# EAGLE design amplifier (EAGLE 9.3.0)
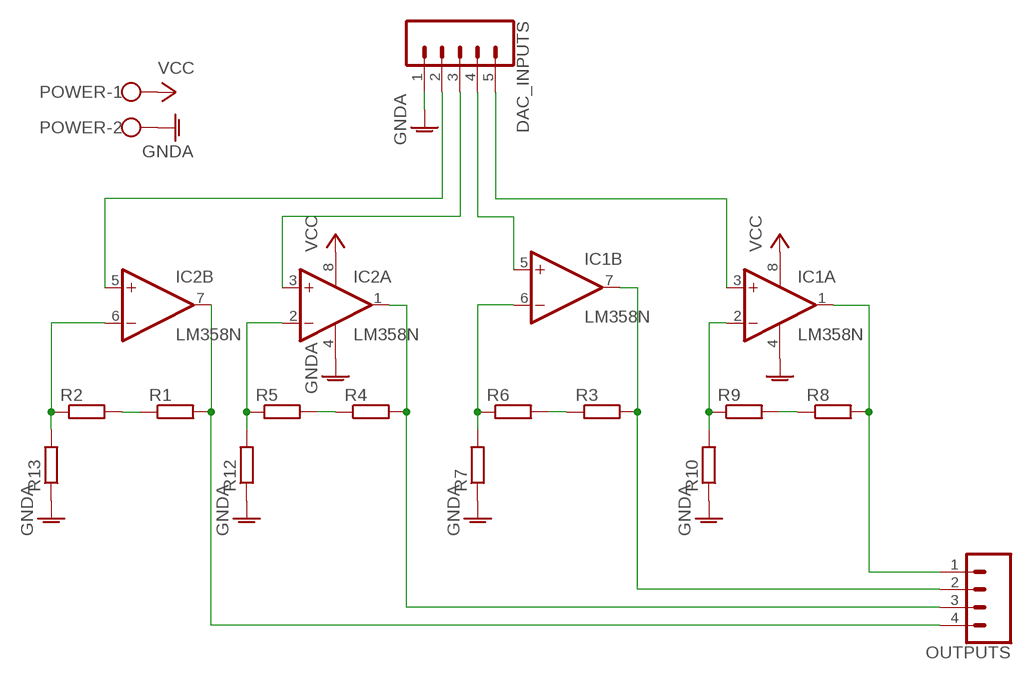
[diagram p0: schematic, sheet 1]

## Parts
DAC_INPUTS  CONN_05  [1X05]
IC1  LM358N  [DIL08]
IC2  LM358N  [DIL08]
OUTPUTS  CONN_04  [1X04]
POWER  W237-102  [W237-102]
R1  R-EU_0204/7  [0204/7]
R2  R-EU_0204/7  [0204/7]
R3  R-EU_0204/7  [0204/7]
R4  R-EU_0204/7  [0204/7]
R5  R-EU_0204/7  [0204/7]
R6  R-EU_0204/7  [0204/7]
R7  R-EU_0204/7  [0204/7]
R8  R-EU_0204/7  [0204/7]
R9  R-EU_0204/7  [0204/7]
R10  R-EU_0204/7  [0204/7]
R12  R-EU_0204/7  [0204/7]
R13  R-EU_0204/7  [0204/7]

## Nets
GNDA: DAC_INPUTS.1 IC1.4(P:V-) IC2.4(P:V-) POWER.2 R7.1 R10.1 R12.1 R13.1
N$1: DAC_INPUTS.5 IC1.3(A:+IN)
N$2: DAC_INPUTS.3 IC2.3(A:+IN)
N$3: DAC_INPUTS.4 IC1.5(B:+IN)
N$4: DAC_INPUTS.2 IC2.5(B:+IN)
N$5: IC2.1(A:OUT) OUTPUTS.3 R4.2
N$6: IC2.2(A:-IN) R5.1 R12.2
N$7: R4.1 R5.2
N$8: IC2.7(B:OUT) OUTPUTS.4 R1.2
N$9: R1.1 R2.2
N$10: IC2.6(B:-IN) R2.1 R13.2
N$11: R3.1 R6.2
N$12: IC1.6(B:-IN) R6.1 R7.2
N$13: IC1.7(B:OUT) OUTPUTS.2 R3.2
N$14: R8.1 R9.2
N$15: IC1.2(A:-IN) R9.1 R10.2
N$16: IC1.1(A:OUT) OUTPUTS.1 R8.2
VCC: IC1.8(P:V+) IC2.8(P:V+) POWER.1

## Library data of the parts
DAC_INPUTS = SparkFun-Connectors:CONN_05: Multi connection point. Often used as Generic Header-pin footprint for 0.1 inch spaced/style header connections On any of the 0.1 inch spaced packages, you can populate with these: Break Away Headers - Straight <https://www.sparkfun.com/products/116> (PRT-00116) Break Away Male Headers - Right Angle <https://www.sparkfun.com/products/553> (PRT-00553) Female Headers <https://www.sparkfun.com/products/115> (PRT-00115) Break Away Headers - Machine Pin <https://www.sparkfun.com/products/117> (PRT-00117) Break Away Female Headers - Swiss Machine Pin <https://www.sparkfun.com/products/743> (PRT-00743) For SCREWTERMINALS and SPRING TERMINALS visit here: Screw Terimnals on SparkFun.com <https://www.sparkfun.com/search/results?term=Screw+Terminals> (5mm/3.5mm/2.54mm spacing) This device is also useful as a general connection point to wire up your design to another part of your project. Our various solder wires solder well into these plated through hole pads. Hook-Up Wire - Assortment (Stranded, 22 AWG) <https://www.sparkfun.com/products/11375> (PRT-11375) Hook-Up Wire - Assortment (Solid Core, 22 AWG) <https://www.sparkfun.com/products/11367> (PRT-11367) View the entire wire category on our website here <https://www.sparkfun.com/categories/141> Special notes: Molex polarized connector foot print use with SKU : PRT-08231 with associated crimp pins and housings. 1MM SMD Version SKU: PRT-10208
IC1 IC2 = linear:LM358: OP AMP also LM158; LM258; LM2904 Source: http://cache.national.com/ds/LM/LM158.pdf
OUTPUTS = SparkFun-Connectors:CONN_04: Multi connection point. Often used as Generic Header-pin footprint for 0.1 inch spaced/style header connections On any of the 0.1 inch spaced packages, you can populate with these: Break Away Headers - Straight <https://www.sparkfun.com/products/116> (PRT-00116) Break Away Male Headers - Right Angle <https://www.sparkfun.com/products/553> (PRT-00553) Female Headers <https://www.sparkfun.com/products/115> (PRT-00115) Break Away Headers - Machine Pin <https://www.sparkfun.com/products/117> (PRT-00117) Break Away Female Headers - Swiss Machine Pin <https://www.sparkfun.com/products/743> (PRT-00743) For SCREWTERMINALS and SPRING TERMINALS visit here: Screw Terimnals on SparkFun.com <https://www.sparkfun.com/search/results?term=Screw+Terminals> (5mm/3.5mm/2.54mm spacing) This device is also useful as a general connection point to wire up your design to another part of your project. Our various solder wires solder well into these plated through hole pads. Hook-Up Wire - Assortment (Stranded, 22 AWG) <https://www.sparkfun.com/products/11375> (PRT-11375) Hook-Up Wire - Assortment (Solid Core, 22 AWG) <https://www.sparkfun.com/products/11367> (PRT-11367) View the entire wire category on our website here <https://www.sparkfun.com/categories/141> Special notes: Molex polarized connector foot print use with SKU : PRT-08231 with associated crimp pins and housings. 1MM SMD Version SKU: PRT-10208; PROD_ID: CONN-09696
POWER = con-wago-500:W237-102: WAGO SCREW CLAMP; MPN: 237-102; OC_FARNELL: unknown; OC_NEWARK: 70K9898
R1-R10 R12 R13 = rcl:R-EU_: RESISTOR, European symbol; SPICEPREFIX: R

## Board
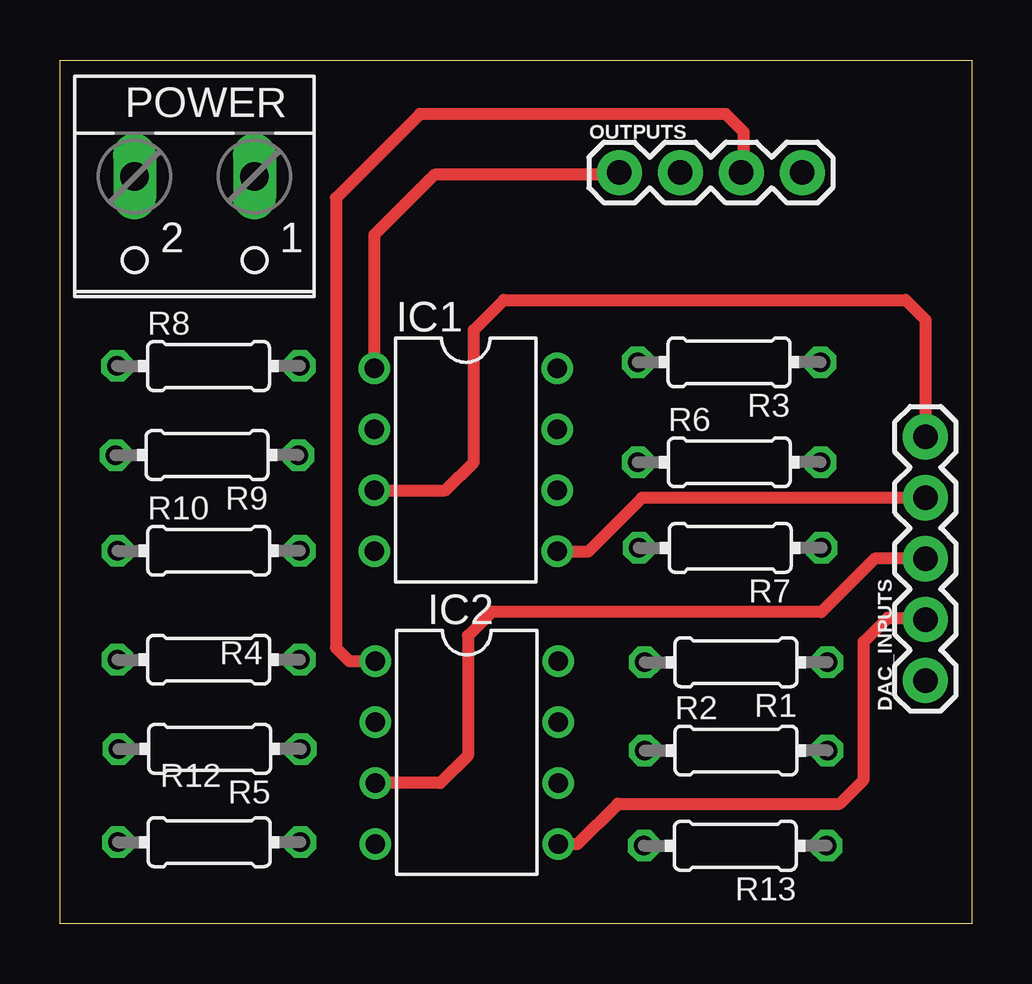
[diagram p1: board, top side]
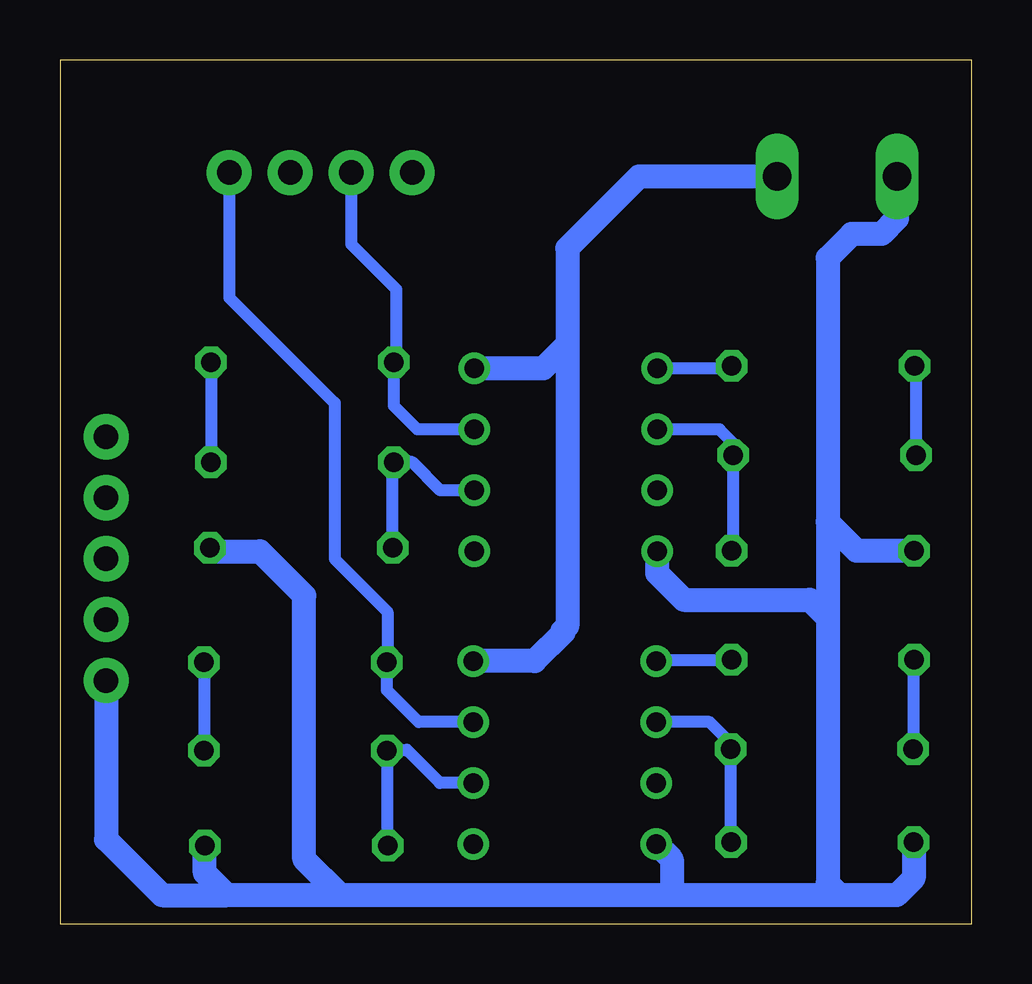
[diagram p2: board, bottom side, seen from below]

Size 38 x 36 mm. Coordinates in mm from the lower left corner, seen from the top.
Outline: 0,36 38,36 38,0 0,0 0,36
Copper layers (1*16): Top 0.018mm / dielectric 1.55mm / Bottom 0.018mm
Design rules "LPKF_GroepT(3)": minimum track width 0.5mm, minimum drill 0.6mm, track to track 0.2mm, track to pad 0.2mm, pad to pad 0.2mm, via to via 0.2mm, smd to smd 0mil, copper to edge 0.25mm, drill to drill 0.35mm, minimum pad ring 0.25mm, minimum via ring 0.5mm, stop-mask expansion 0mil, vias tented up to drill 0.45mm, thermal gap 0.2mm

### Footprints (pad centres in the part's own frame; a part is rotated, then mirrored left to right if it is on the bottom)
1X05 = drill 1.016 pad 1.88: 1 0,0; 2 2.54,0; 3 5.08,0; 4 7.62,0; 5 10.16,0
DIL08 = drill 0.813 pad 1.27: 1 -3.81,-3.81; 2 -1.27,-3.81; 3 1.27,-3.81; 4 3.81,-3.81; 5 3.81,3.81; 6 1.27,3.81; 7 -1.27,3.81; 8 -3.81,3.81
1X04 = drill 1.016 pad 1.88: 1 0,0; 2 2.54,0; 3 5.08,0; 4 7.62,0
W237-102 = drill 1.194 long: 1 -2.5,-1.27; 2 2.5,-1.27
0204/7 = drill 0.813 octagon: 1 -3.81,0; 2 3.81,0

### Placement (x,y rotation side)
DAC_INPUTS  36.08,10.13 90 top
IC1  16.92,19.33 270 top
IC2  16.96,7.13 270 top
OUTPUTS  23.32,31.31 0 top
POWER  5.61,29.87 180 top
R1  28.18,10.89 180 top
R2  28.18,7.21 0 top
R3  27.89,23.4 180 top
R4  6.2,11 0 top
R5  6.24,7.28 180 top
R6  27.9,19.23 0 top
R7  27.94,15.66 180 top
R8  6.19,23.24 0 top
R9  6.13,19.53 180 top
R10  6.2,15.54 0 top
R12  6.22,3.39 0 top
R13  28.15,3.24 180 top

### Tracks (layer width: path | path; a pad name or v marks a point on that pad's centre or on a via)
GNDA
  Bottom 1: R7.1 31.61,15.52 29.66,15.52 27.82,13.67 27.82,2.68 26.31,1.18 | R13.1 31.96,2.11 31.03,1.18 | R12.1 2.41,1.89 3.12,1.18 5.5,1.18 | 12.5,1.18 26.31,1.18 | DAC_INPUTS.1 36.08,3.51 33.75,1.18 31.03,1.18 | 26.31,1.18 31.03,1.18 | IC2.4 12.5,2.67 12.5,1.18 | 5.5,1.18 12.5,1.18 | POWER.2 3.11,29.39 3.75,28.75 5,28.75 6,27.75 6,16.75 | 6,16.75 6,12.75 | 6,12.75 6,1.68 5.5,1.18 | R10.1 4.79,15.54 6,16.75 | IC1.4 13.11,14.61 12,13.5 6.75,13.5 6,12.75
N$1
  Top 0.5: IC1.3 16.06,18.06 17.25,19.25 17.25,24.75 18.5,26 35.25,26 36.08,25.17 DAC_INPUTS.5
N$2
  Top 0.5: DAC_INPUTS.3 33.96,15.21 31.73,12.98 18.02,12.98 18,13 17,12 17,7 15.86,5.86 IC2.3
N$3
  Top 0.5: DAC_INPUTS.4 24.25,17.75 22,15.5 20.75,15.5 IC1.5
N$4
  Top 0.5: DAC_INPUTS.2 36,12.75 34.5,12.75 33.5,11.75 33.5,6 32.5,5 23.25,5 21.57,3.32 IC2.5
N$5
  Top 0.5: OUTPUTS.3 28.5,31.41 28.5,33 27.75,33.75 15,33.75 11.5,30.25 11.5,11.5 12.06,10.94 IC2.1
  Bottom 0.5: IC2.1 13.09,11 R4.2
N$6
  Bottom 0.5: IC2.2 10.92,8.4 10.05,7.53 R5.1 10.05,3.41 R12.2
N$7
  Bottom 0.5: R4.1 2.43,10.96 R5.2
N$8
  Bottom 0.5: IC2.7 23.05,8.4 24.37,9.72 24.37,10.6 | 24.37,10.6 R1.2 | OUTPUTS.4 30.94,26.09 26.55,21.7 26.55,15.2 24.35,13 24.35,10.62 24.37,10.6
N$9
  Bottom 0.5: R1.1 R2.2
N$10
  Bottom 0.5: IC2.6 22.16,5.86 23.54,7.24 23.57,7.21 R2.1 24.37,3.27 R13.2
N$11
  Bottom 0.5: R3.1 R6.2
N$12
  Bottom 0.5: IC1.6 22.14,18.06 23.31,19.23 R6.1 24.13,19.19 R7.2
N$13
  Bottom 0.5: OUTPUTS.2 25.86,28.32 23.98,26.44 23.98,23.35 24.08,23.25 | IC1.7 23.1,20.6 24.08,21.58 24.08,23.25 | 24.08,23.25 R3.2
N$14
  Bottom 0.5: R8.1 2.32,23.18 R9.2
N$15
  Bottom 0.5: IC1.2 10.51,20.6 9.94,20.03 R9.1 9.94,15.61 R10.2
N$16
  Top 0.5: OUTPUTS.1 23.22,31.21 15.61,31.21 13.11,28.71 IC1.1
  Bottom 0.5: R8.2 10.1,23.14 IC1.1
VCC
  Bottom 1: POWER.1 13.86,31.14 16.85,28.15 16.85,24.15 | IC2.8 18.21,10.94 17.01,12.14 17.06,12.19 16.85,12.4 16.85,24.15 | 16.85,24.15 17.86,23.14 IC1.8